# Altium schematic sheet 04.2_Thermocouple_Handling_01.SchDoc
size A4; SheetNumber: 5; SheetTotal: 8
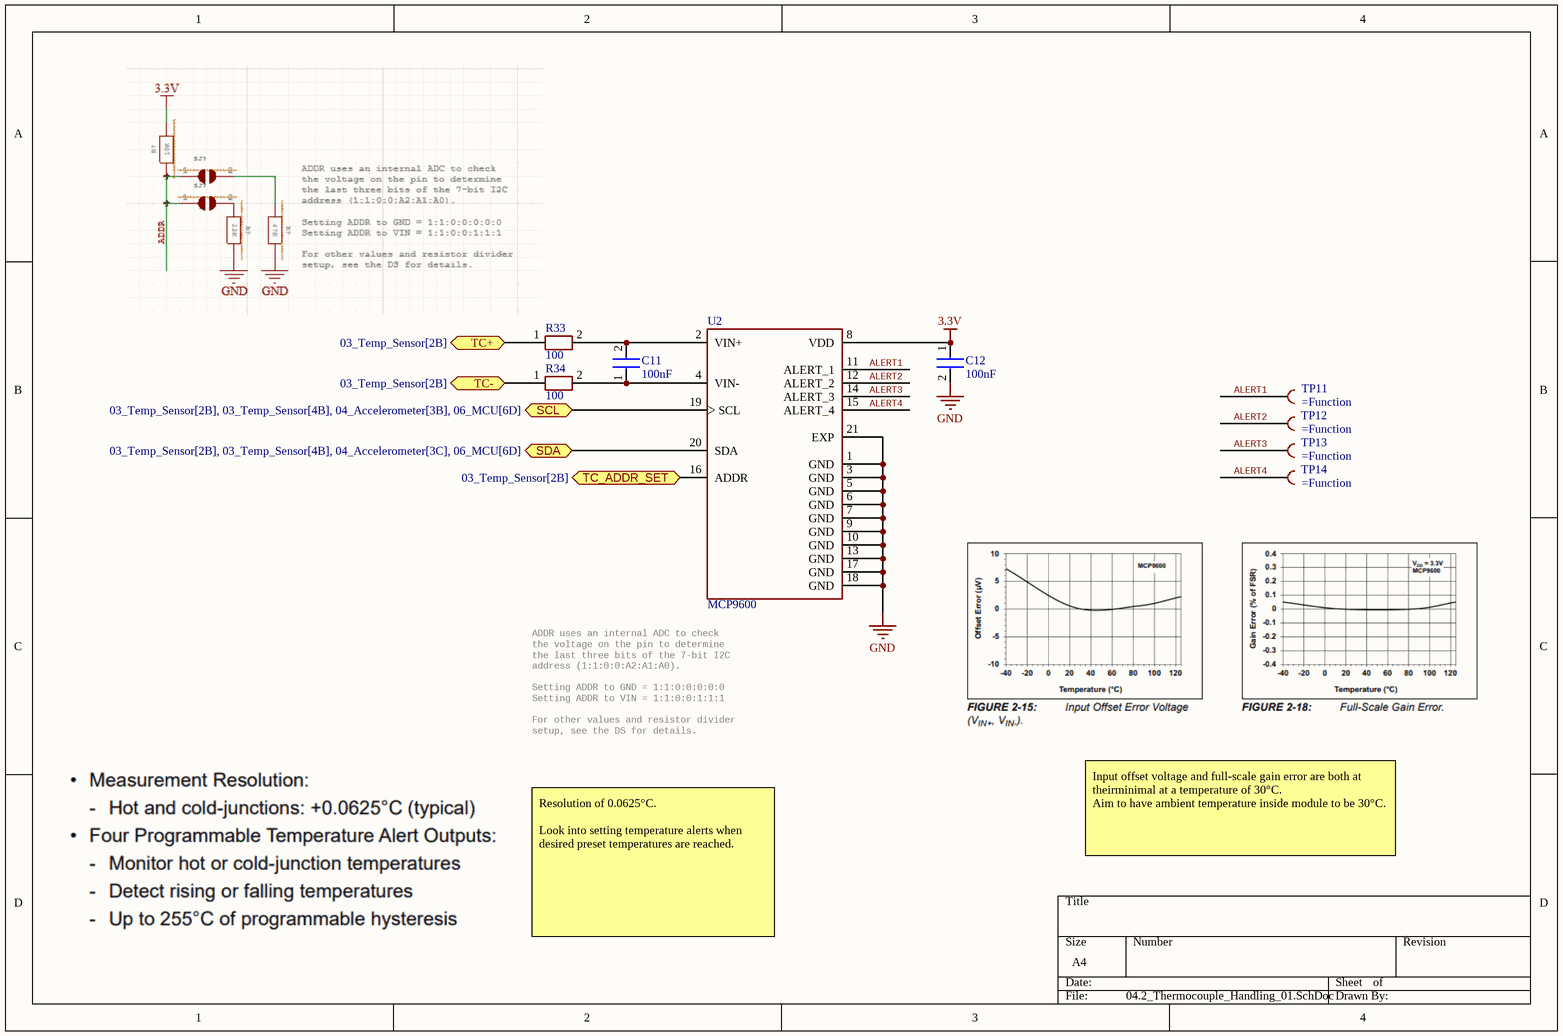
[diagram p0: 04.2_Thermocouple_Handling_01.SchDoc]

## Parts
C11  100nF  [CAPC2012X94N]
C12  100nF  [CAPC2012X94N]
R33  100  [RESC2012X60N]
R34  100  [RESC2012X60N]
TP11  (no value)  [TP_Pad_TH_1.2P_0.6H]  (no BOM)
TP12  (no value)  [TP_Pad_TH_1.2P_0.6H]  (no BOM)
TP13  (no value)  [TP_Pad_TH_1.2P_0.6H]  (no BOM)
TP14  (no value)  [TP_Pad_TH_1.2P_0.6H]  (no BOM)
U2  MCP9600  [QFN65P500X500X100-21N]

## Ports
SCL (bidir, see 03_Temp_Sensor[2B], 03_Temp_Sensor[4B], 04_Accelerometer[3B], 06_MCU[6D]), SDA (bidir, see 03_Temp_Sensor[2B], 03_Temp_Sensor[4B], 04_Accelerometer[3C], 06_MCU[6D]), TC+ (bidir, see 03_Temp_Sensor[2B]), TC- (bidir, see 03_Temp_Sensor[2B]), TC_ADDR_SET (bidir, see 03_Temp_Sensor[2B])

## Nets
3.3V: C12.1 U2.8(VDD)
GND: C12.2 U2.1(GND) U2.3(GND) U2.5(GND) U2.6(GND) U2.7(GND) U2.9(GND) U2.10(GND) U2.13(GND) U2.17(GND) U2.18(GND) U2.21(EXP)
ALERT1: TP11.TP U2.11(ALERT_1)
ALERT2: TP12.TP U2.12(ALERT_2)
ALERT3: TP13.TP U2.14(ALERT_3)
ALERT4: TP14.TP U2.15(ALERT_4)
SCL: U2.19(SCL) ; port SCL
SDA: U2.20(SDA) ; port SDA
TC+: R33.1 ; port TC+
TC-: R34.1 ; port TC-
TC_ADDR_SET: U2.16(ADDR) ; port TC_ADDR_SET
NetC11_1: C11.1 R34.2 U2.4(VIN-)
NetC11_2: C11.2 R33.2 U2.2(VIN+)

## Notes on the sheet
- (near U2) ADDR uses an internal ADC to check
  the voltage on the pin to determine
  the last three bits of the 7-bit I2C
  address (1:1:0:0:A2:A1:A0).
  Setting ADDR to GND = 1:1:0:0:0:0:0
  Setting ADDR to VIN = 1:1:0:0:1:1:1
  For other values and resistor divider
  setup, see the DS for details.
- Input offset voltage and full-scale gain error are both at theirminimal at a temperature of 30°C.
  Aim to have ambient temperature inside module to be 30°C.
- Resolution of 0.0625°C.
  Look into setting temperature alerts when desired preset temperatures are reached.

## Library data of the parts
C11 C12 = CAP CER 100nF 0805 SMD: Capacitor; Manufacturer_Part_Number: 08055C104KAZ2A; ComponentLink1Description: Datasheet; ComponentLink1URL: http://datasheets.avx.com/X7RDielectric.pdf
R33 R34 = RES 100 0805 SMD: Resistor; Manufacturer_Part_Number: 1623096-1
TP11-TP14 = TP 1.5mm PAD
U2 = IC TYPE_K AMP I2Q MCP9600-I/MX SMD: MCP9600 Series Thermocouple Electromotive Force to Â±1.5Â°C Converter - VQFN-2; Manufacturer_Part_Number: MCP9600-E/MX; ComponentLink1Description: Datasheet; ComponentLink1URL: https://www.mouser.co.za/datasheet/2/268/MCP960X_L0X_RL0X_Thermocouple_EMF_to_Temperature_C-3443378.pdf